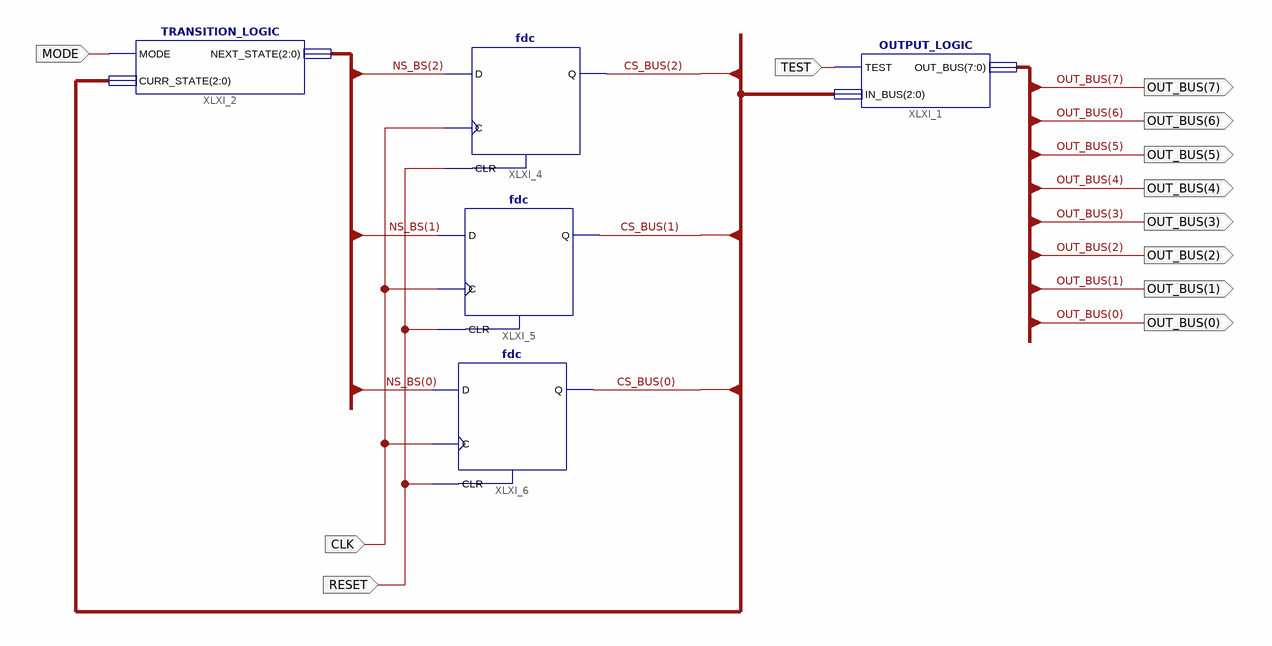
[diagram p0: schematic sheet 1]
// Xilinx ISE schematic LIGHT_CONTROLLER.sch (spartan3a) as structural Verilog: 5 symbols, 12 ports
module LIGHT_CONTROLLER (
  input  MODE,
  input  CLK,
  input  RESET,
  input  TEST,
  output [7:0] OUT_BUS
);

  wire [2:0] CS_BUS, NS_BS;

  fdc XLXI_5 (.C(CLK), .CLR(RESET), .D(NS_BS[1]), .Q(CS_BUS[1]));
  fdc XLXI_6 (.C(CLK), .CLR(RESET), .D(NS_BS[0]), .Q(CS_BUS[0]));
  fdc XLXI_4 (.C(CLK), .CLR(RESET), .D(NS_BS[2]), .Q(CS_BUS[2]));
  TRANSITION_LOGIC XLXI_2 (.MODE(MODE), .CURR_STATE(CS_BUS), .NEXT_STATE(NS_BS));
  OUTPUT_LOGIC XLXI_1 (.TEST(TEST), .IN_BUS(CS_BUS), .OUT_BUS(OUT_BUS));
endmodule
